# Altium schematic sheet rev02_20.SchDoc
size 282 x 200 mm
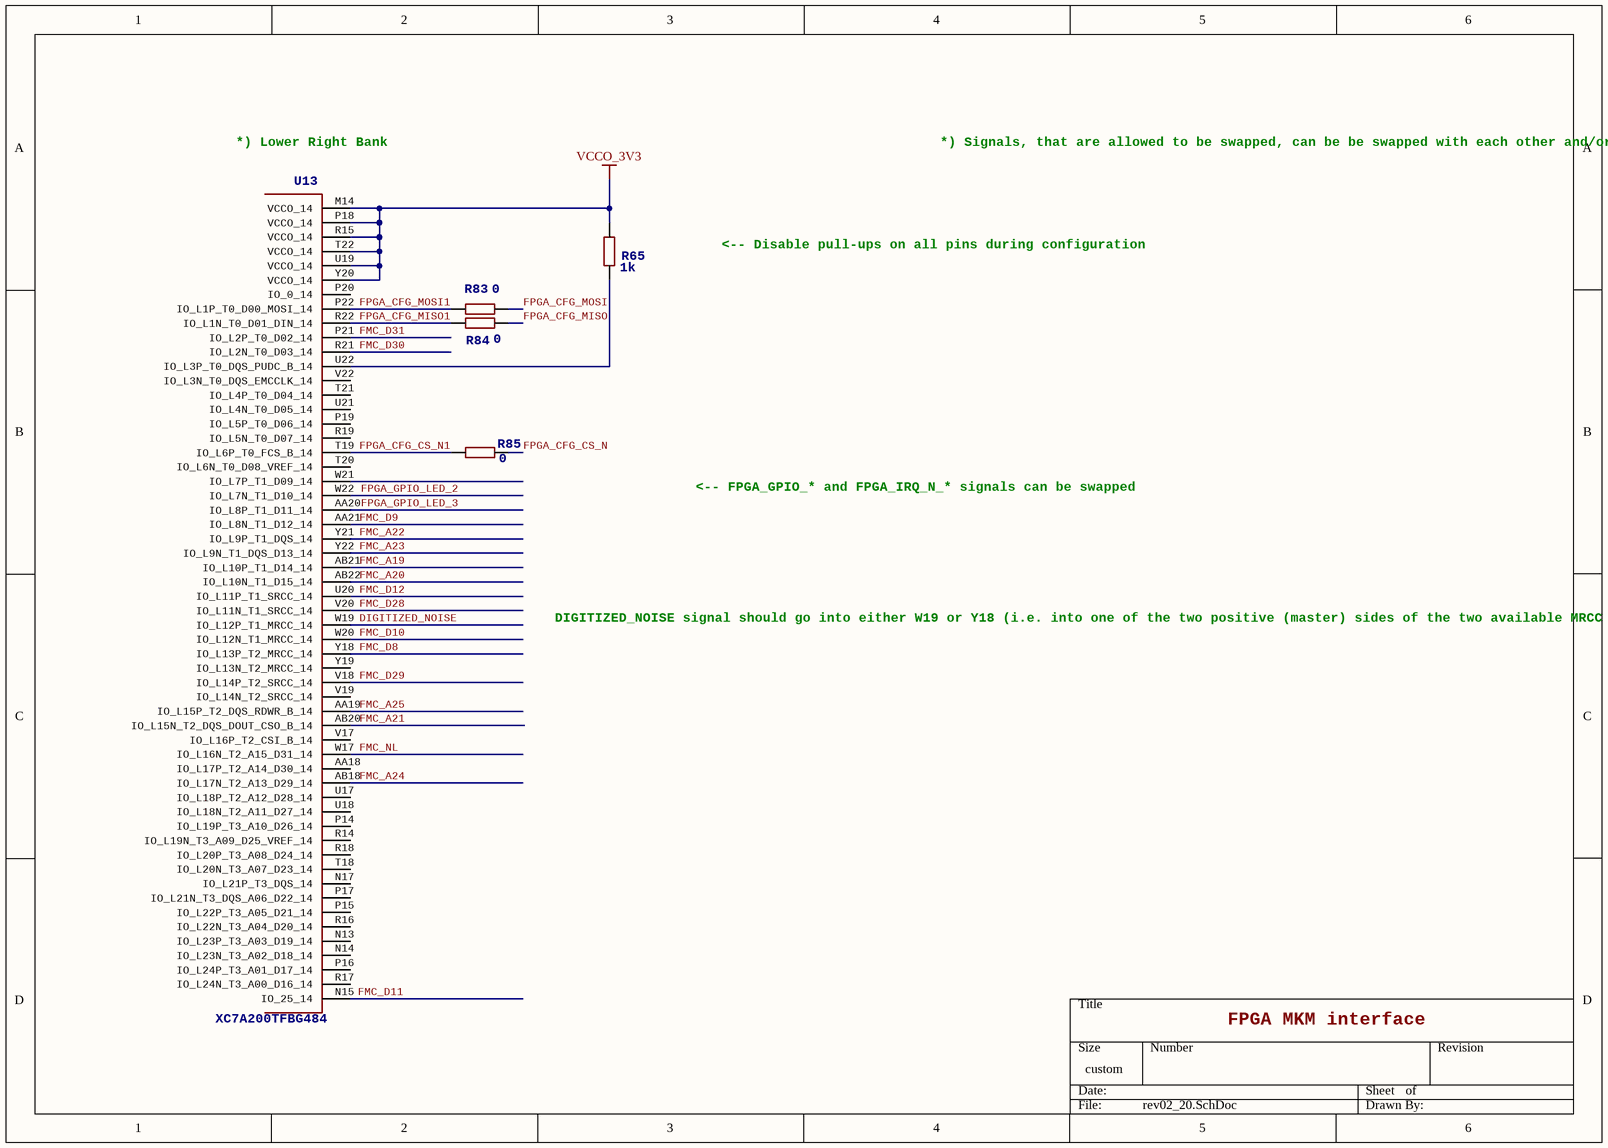
[diagram p0: rev02_20.SchDoc]

## Parts
R65  value 1k  >NAME: R65  [R_0402]
R83  value 0  [R_0402]
R84  value 0  [R_0402]
R85  value 0  [R_0402]
U13  >NAME: U13  [BGA484C100P22X22_2300X2300X254]  (hidden comment: XC7A200TFBG484)  (part C of 17)

## Nets
VCCO_3V3: R65.2 U13.M14(VCCO_14) U13.P18(VCCO_14) U13.R15(VCCO_14) U13.T22(VCCO_14) U13.U19(VCCO_14) U13.Y20(VCCO_14)
DIGITIZED_NOISE: U13.W19(IO_L12P_T1_MRCC_14)
FMC_A19: U13.AB21(IO_L10P_T1_D14_14)
FMC_A20: U13.AB22(IO_L10N_T1_D15_14)
FMC_A21: U13.AB20(IO_L15N_T2_DQS_DOUT_CSO_B_14)
FMC_A22: U13.Y21(IO_L9P_T1_DQS_14)
FMC_A23: U13.Y22(IO_L9N_T1_DQS_D13_14)
FMC_A24: U13.AB18(IO_L17N_T2_A13_D29_14)
FMC_A25: U13.AA19(IO_L15P_T2_DQS_RDWR_B_14)
FMC_D8: U13.Y18(IO_L13P_T2_MRCC_14)
FMC_D9: U13.AA21(IO_L8N_T1_D12_14)
FMC_D10: U13.W20(IO_L12N_T1_MRCC_14)
FMC_D11: U13.N15(IO_25_14)
FMC_D12: U13.U20(IO_L11P_T1_SRCC_14)
FMC_D28: U13.V20(IO_L11N_T1_SRCC_14)
FMC_D29: U13.V18(IO_L14P_T2_SRCC_14)
FMC_D30: U13.R21(IO_L2N_T0_D03_14)
FMC_D31: U13.P21(IO_L2P_T0_D02_14)
FMC_NL: U13.W17(IO_L16N_T2_A15_D31_14)
FPGA_CFG_CS_N: R85.1
FPGA_CFG_CS_N1: R85.2 U13.T19(IO_L6P_T0_FCS_B_14)
FPGA_CFG_MISO: R84.1
FPGA_CFG_MISO1: R84.2 U13.R22(IO_L1N_T0_D01_DIN_14)
FPGA_CFG_MOSI: R83.1
FPGA_CFG_MOSI1: R83.2 U13.P22(IO_L1P_T0_D00_MOSI_14)
FPGA_GPIO_LED_2: U13.W22(IO_L7N_T1_D10_14)
FPGA_GPIO_LED_3: U13.AA20(IO_L8P_T1_D11_14)
NetR65_1: R65.1 U13.U22(IO_L3P_T0_DQS_PUDC_B_14)

Not connected (* = marked no-connect by the designer): U13 AA18(IO_L17P_T2_A14_D30_14) N13(IO_L23P_T3_A03_D19_14) N14(IO_L23N_T3_A02_D18_14) N17(IO_L21P_T3_DQS_14) P14(IO_L19P_T3_A10_D26_14) P15(IO_L22P_T3_A05_D21_14) P16(IO_L24P_T3_A01_D17_14) P17(IO_L21N_T3_DQS_A06_D22_14) P19(IO_L5P_T0_D06_14) P20(IO_0_14) R14(IO_L19N_T3_A09_D25_VREF_14) R16(IO_L22N_T3_A04_D20_14) R17(IO_L24N_T3_A00_D16_14) R18(IO_L20P_T3_A08_D24_14) R19(IO_L5N_T0_D07_14) T18(IO_L20N_T3_A07_D23_14) T20(IO_L6N_T0_D08_VREF_14) T21(IO_L4P_T0_D04_14) U17(IO_L18P_T2_A12_D28_14) U18(IO_L18N_T2_A11_D27_14) U21(IO_L4N_T0_D05_14) V17(IO_L16P_T2_CSI_B_14) V19(IO_L14N_T2_SRCC_14) V22(IO_L3N_T0_DQS_EMCCLK_14) W21(IO_L7P_T1_D09_14) Y19(IO_L13N_T2_MRCC_14)

## Notes on the sheet
- *) Lower Right Bank
- *) Signals, that are allowed to be swapped, can be be swapped
  with each other and/or moved to different pins within their bank.
- <-- Disable pull-ups on all pins during configuration
- <-- FPGA_GPIO_* and FPGA_IRQ_N_* signals can be swapped
- DIGITIZED_NOISE signal should go into
  either W19 or Y18 (i.e. into one of the two
  positive (master) sides of the two available
  MRCC differential pairs)
- FPGA MKM interface

## Library data of the parts
R65 = R-EU_R0402: 0402 Resistor 5%; TOLERANCE: 5%
R83-R85 = R-EU_R0603: 0402 Resistor 5%
U13 = XC7A200TFBG484: Xilinx FPGA: XC7A200TFBG484; MPN: XC7A200T-1FBG484C; MFR: Xilinx; OC_DIGIKEY: 122-1871-ND; >VALUE: XC7A200TFBG484